# EAGLE design rx (EAGLE 9.2.2)
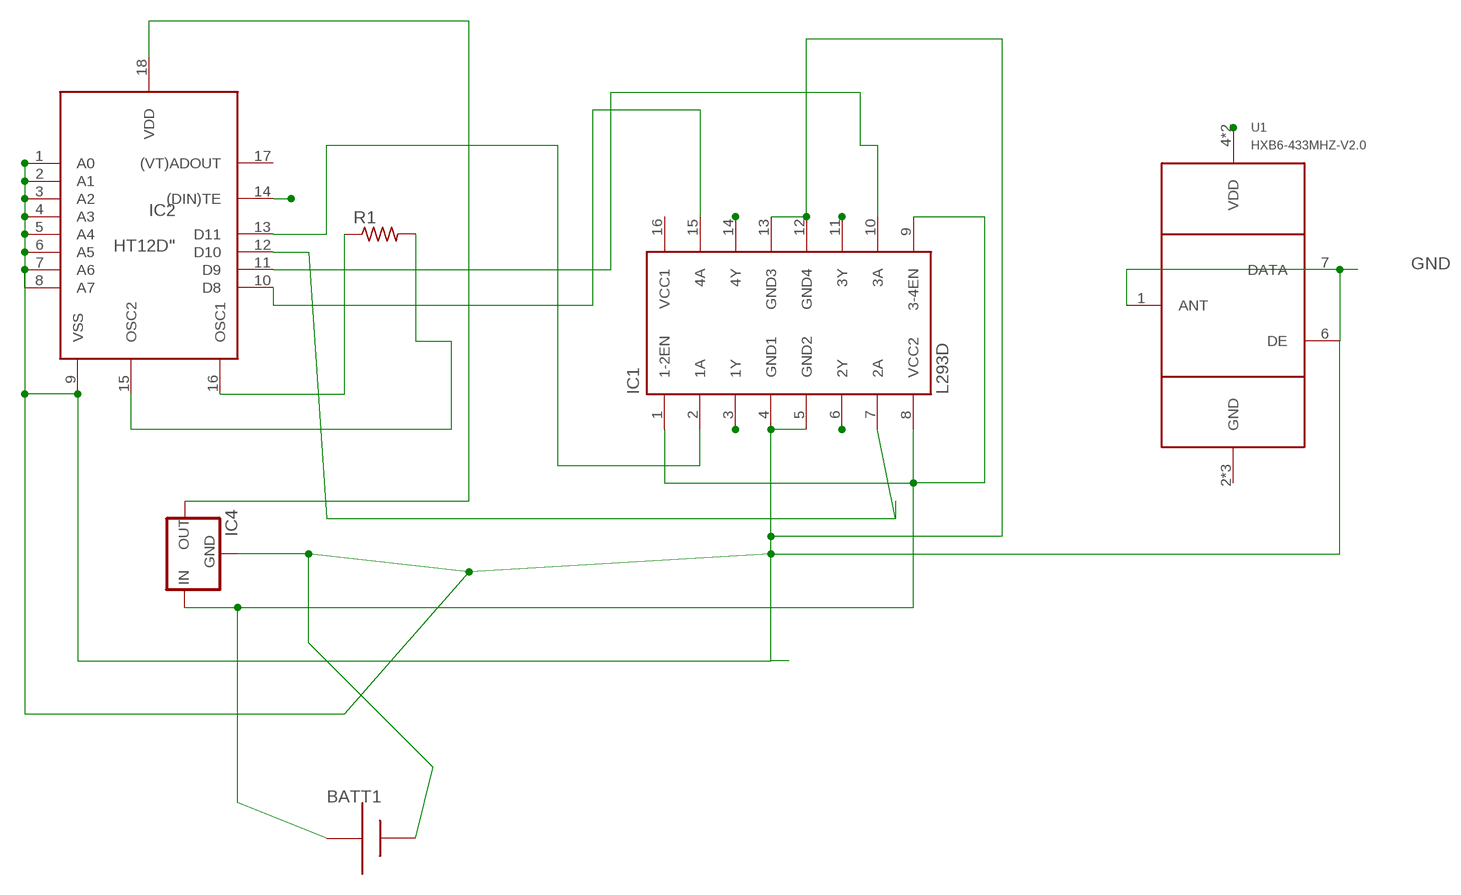
[diagram p0: schematic, sheet 1]

## Parts
BATT1  AAA  [12BH412]
IC1  L293D  [DIL16]
IC2  HT12D"  [18-DIP-A]
IC4  78XXS  [78XXS]
R1  R-US_0207/9  [0207/9]
U1  HXB6-433MHZ-V2.0  [RXB6-XXX-V]

## Nets
GND: BATT1.+ IC1.4(GND1) IC1.5(GND2) IC1.12(GND4) IC1.13(GND3) IC2.1(A0) IC2.2(A1) IC2.3(A2) IC2.4(A3) IC2.5(A4) IC2.6(A5) IC2.7(A6) IC2.8(A7) IC2.9(VSS) IC4.GND U1.1(ANT) U1.6(DE) U1.7(DATA)
N$1: IC2.14((DIN)TE)
N$2: IC2.18(VDD) IC4.OUT
N$3: IC2.16(OSC1) R1.1
N$4: IC2.15(OSC2) R1.2
N$7: IC1.2(1A) IC2.13(D11)
N$8: IC1.7(2A) IC2.12(D10)
N$9: IC1.10(3A) IC2.11(D9)
N$10: IC1.15(4A) IC2.10(D8)
N$14: IC1.14(4Y)
N$15: BATT1.- IC1.1(1-2EN) IC1.8(VCC2) IC1.9(3-4EN) IC4.IN
N$16: IC1.11(3Y)
N$17: IC1.6(2Y)
N$18: IC1.3(1Y)
VDD: U1.4(VDD) U1.5(VDD)
Unconnected: IC2.17((VT)ADOUT) U1.2(GND) U1.3(GND) U1.8(GND)

## Power pins joined to a net without a drawn wire
VCC1: IC1.16(VCC1)

## Library data of the parts
BATT1 = adafruit:AAA: AAA PC pin holder Mouser part #12BH412 - but pretty much any 1x AAA battery holder should be the same http://www.ladyada.net/library/pcb/eaglelibrary.html
IC1 = st-microelectronics:L293D: PUSH-PULL 4 CHANNEL DRIVER; MPN: L293D; OC_FARNELL: 9589619; OC_NEWARK: 56P8249
IC2 = holtek:HT12D: decoder = receiver ic
IC4 = v-reg:78XXS: VOLTAGE REGULATOR
R1 = adafruit:R-US_: RESISTOR, American symbol
U1 = JMR_RF_Lib:HXB6-*

## Net classes
0 default: width 0.762 mm, drill 0.508 mm, clearance 0.381 mm

## Board
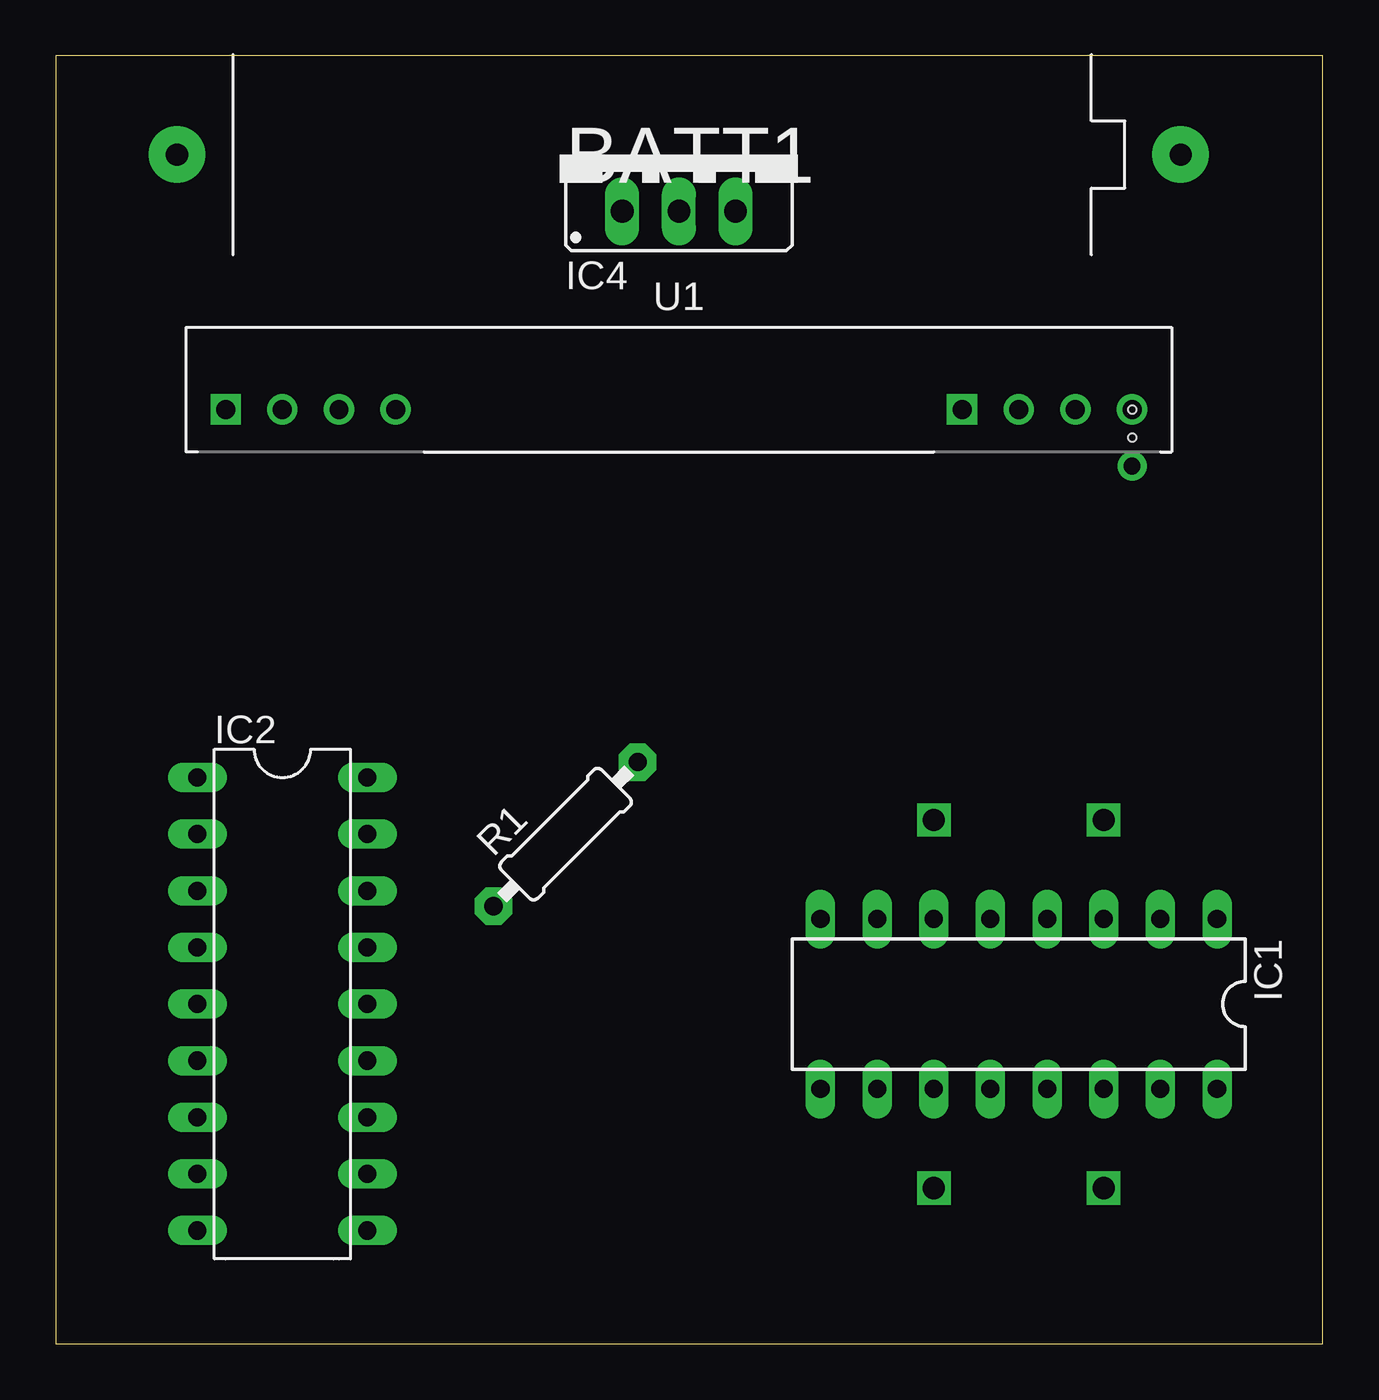
[diagram p1: board, top side]
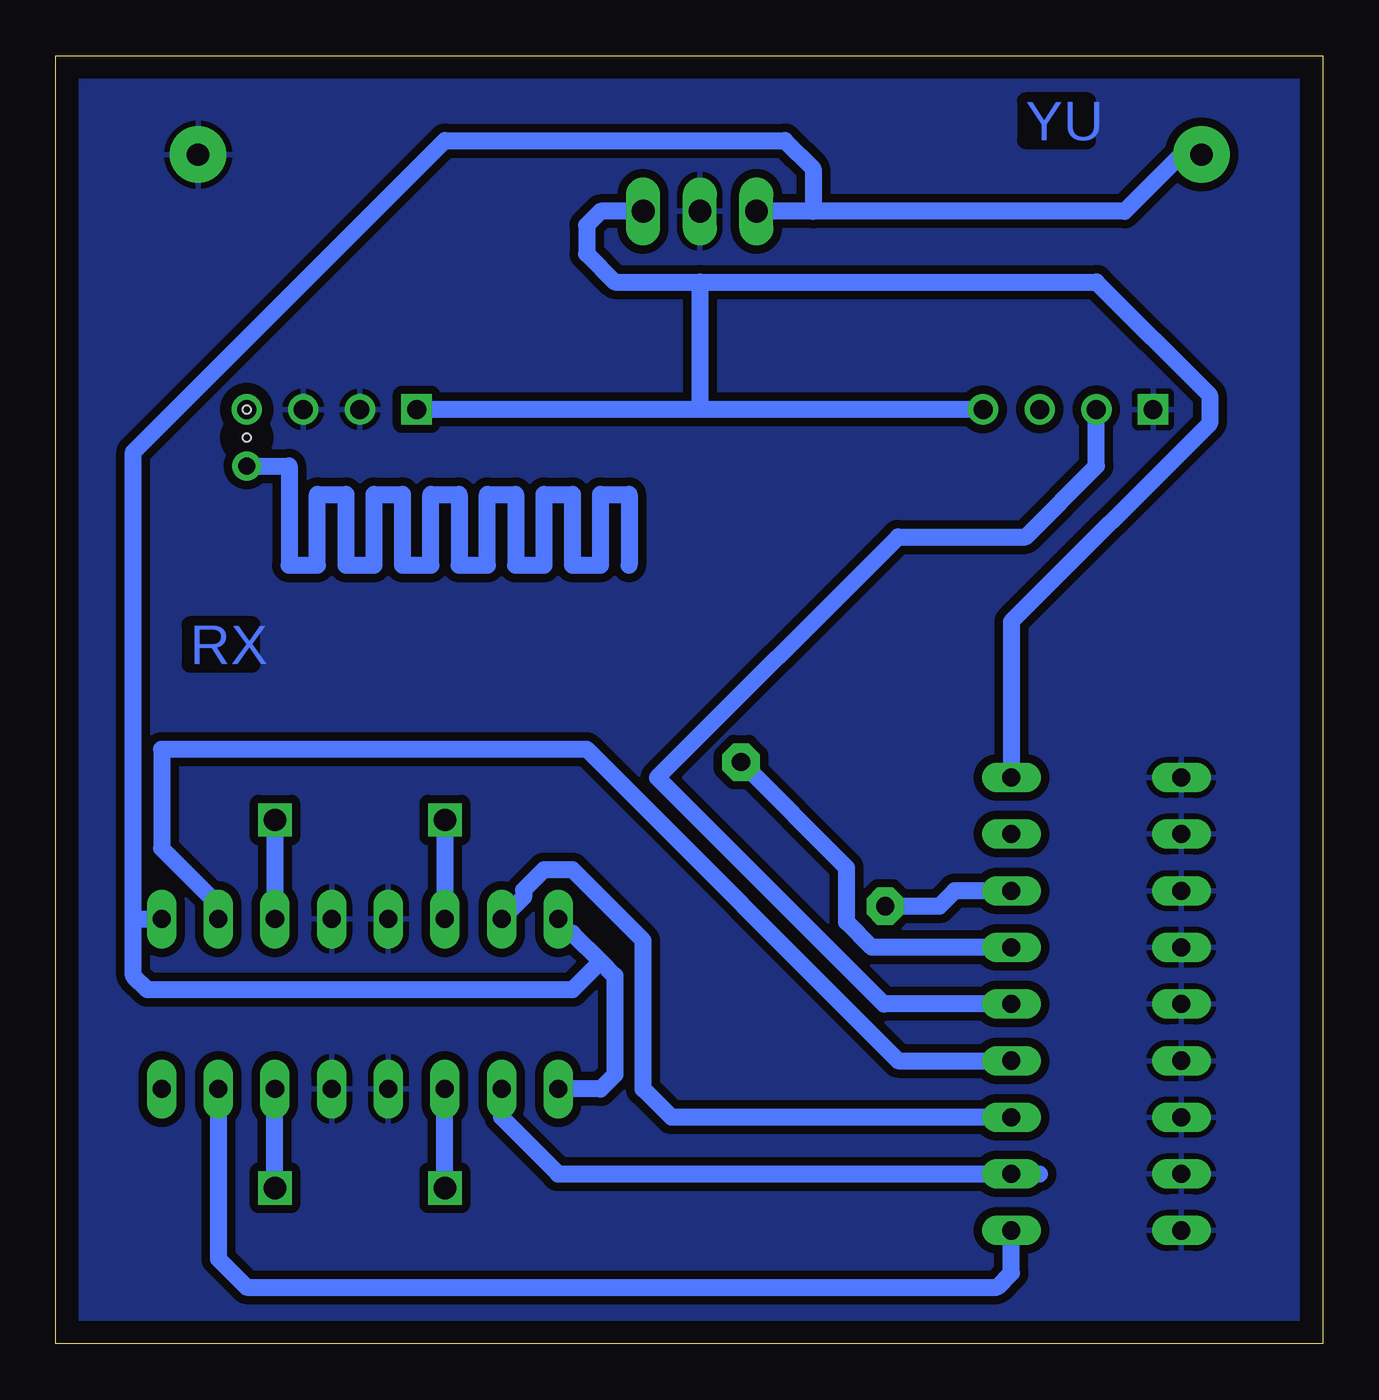
[diagram p2: board, bottom side, seen from below]

Size 56.82 x 57.77 mm. Coordinates in mm from the lower left corner, seen from the top.
Outline: 0,0 56.82,0 56.82,57.77 0,57.77 0,0
Copper layers (1*16): Top 0.035mm / dielectric 1.5mm / Bottom 0.035mm
Design rules "default": minimum track width 6mil, minimum drill 0.35mm, track to track 6mil, track to pad 6mil, pad to pad 6mil, via to via 6mil, smd to smd 6mil, copper to edge 40mil, drill to drill 6mil, minimum pad ring 10mil, minimum via ring 8mil, stop-mask expansion 4mil, vias tented up to drill 0mil, thermal gap 10mil
Holes 0.35 mm at 48.26,41.91 48.26,40.64

### Footprints (pad centres in the part's own frame; a part is rotated, then mirrored left to right if it is on the bottom)
12BH412 = drill 1 pad 2.54: + 22.5,0; - -22.5,0
DIL16 = drill 0.813 long: 1 -8.89,-3.81; 2 -6.35,-3.81; 3 -3.81,-3.81; 4 -1.27,-3.81; 5 1.27,-3.81; 6 3.81,-3.81; 7 6.35,-3.81; 8 8.89,-3.81; 9 8.89,3.81; 10 6.35,3.81; 11 3.81,3.81; 12 1.27,3.81; 13 -1.27,3.81; 14 -3.81,3.81; 15 -6.35,3.81; 16 -8.89,3.81
18-DIP-A = drill 0.813 long: 1 -10.16,-3.81; 2 -7.62,-3.81; 3 -5.08,-3.81; 4 -2.54,-3.81; 5 0,-3.81; 6 2.54,-3.81; 7 5.08,-3.81; 8 7.62,-3.81; 9 10.16,-3.81; 10 10.16,3.81; 11 7.62,3.81; 12 5.08,3.81; 13 2.54,3.81; 14 0,3.81; 15 -2.54,3.81; 16 -5.08,3.81; 17 -7.62,3.81; 18 -10.16,3.81
78XXS = drill 1.016 long: GND 0,-2.54; IN -2.54,-2.54; OUT 2.54,-2.54
0207/9 = drill 0.813 pad 1.676 octagon: 1 -4.572,0; 2 4.572,0
RXB6-XXX-V = drill 0.85 square: 1 -20.32,0; 5 12.7,0 | drill 0.85: 2 -17.78,0; 3 -15.24,0; 4 -12.7,0; 6 15.24,0; 7 17.78,0; 8 20.32,0

### Placement (x,y rotation side)
BATT1  27.94,53.34 0 top
IC1  43.18,15.24 180 top
IC2  10.16,15.24 270 top
IC4  27.94,53.34 0 top
R1  22.86,22.86 45 top
U1  27.94,41.91 0 top

### Tracks (layer width: path | path; a pad name or v marks a point on that pad's centre or on a via)
GND
  pour Bottom: -2.54,64.77 -2.54,-2.54 59.69,-2.54 59.69,68.58 -2.54,68.58
N$1
  Bottom 0.762: IC2.14 19.68,15.24 29.84,25.4 19.05,36.2 13.34,36.2 10.16,39.37 10.16,41.91
N$2
  Bottom 0.762: IC2.18 13.97,32.38 5.08,41.27 5.08,42.55 10.16,47.62 27.94,47.62 | 27.94,47.62 31.75,47.62 33.02,48.9 33.02,50.16 32.38,50.8 IC4.OUT | 27.94,47.62 27.94,41.91
N$3
  Bottom 0.762: IC2.16 16.51,20.32 17.2,19.63 R1.1
N$4
  Bottom 0.762: R1.2 21.35,21.35 21.35,18.91 20.22,17.78 IC2.15
N$5  (via drill 0.75 pad 1.3)
  Bottom 0.762: v48.26,39.37 46.35,39.37 46.35,34.92 45.09,34.92 45.09,38.1 43.81,38.1 43.81,34.92 42.55,34.92 42.55,38.1 41.27,38.1 41.27,34.92 40.01,34.92 40.01,38.1 38.73,38.1 38.73,34.92 37.47,34.92 37.47,38.1 36.2,38.1 36.2,34.92 34.92,34.92 34.92,38.1 33.66,38.1 33.66,34.92 32.38,34.92 32.38,38.1 31.11,38.1 31.11,34.92
N$6  (via drill 1 pad 1.3)
  Bottom 0.762: v46.99,23.5 46.99,19.05
N$7
  Bottom 0.762: IC2.13 19.05,12.7 33.02,26.67 52.07,26.67 52.07,22.23 49.53,19.68 IC1.2
N$8
  Bottom 0.762: IC1.7 35.84,20.04 35.84,20.35 34.93,21.26 33.65,21.26 30.48,18.09 30.48,11.43 29.21,10.16 IC2.12
N$9
  Bottom 0.762: 12.7,7.62 IC2.11 34.29,7.62 36.83,10.16 IC1.10
N$10
  Bottom 0.762: IC2.10 13.97,3.17 14.61,2.54 48.26,2.54 49.53,3.81 IC1.15
N$11  (via drill 1 pad 1.3)
  Bottom 0.762: v39.37,23.5 39.37,19.05
N$12  (via drill 1 pad 1.3)
  Bottom 0.762: v39.37,6.99 39.37,11.43
N$13  (via drill 1 pad 1.3)
  Bottom 0.762: v46.99,6.99 46.99,11.43
N$15
  Bottom 0.762: 5.71,53.98 5.08,53.34 BATT1.- 5.71,53.98 | 22.86,50.8 8.89,50.8 5.71,53.98 | 22.86,50.8 IC4.IN | IC1.9 32.38,11.43 31.75,12.06 31.75,16.51 32.38,17.14 | 32.38,17.14 33.66,18.41 34.29,18.41 IC1.8 | 53.34,19.05 IC1.1 | 53.34,19.05 53.34,16.51 52.7,15.88 33.66,15.88 32.38,17.14 | 22.86,50.8 22.86,52.7 24.13,53.98 39.37,53.98 53.34,40.01 53.34,19.05
VDD
  Bottom 0.762: U1.4 U1.5

### Text on the board
Bottom: YU | RX